# Altium schematic sheet main sheet.SchDoc
size A4
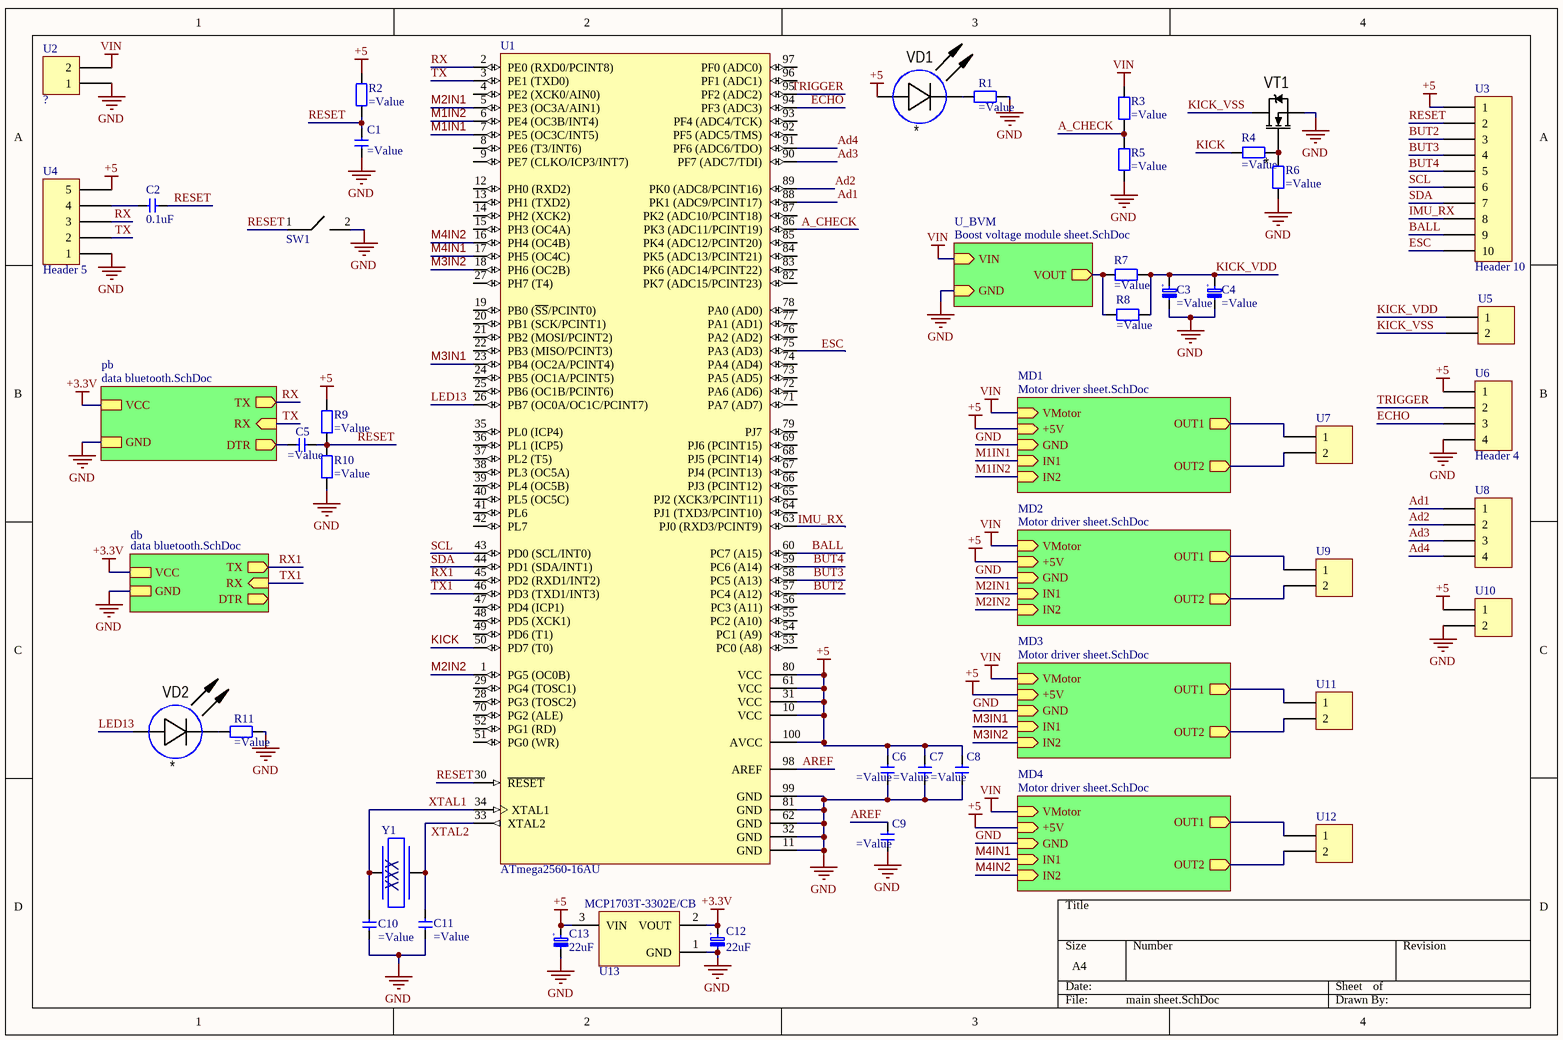
[diagram p0: main sheet.SchDoc]

## Parts
C1  (no value)  [cap0603]
C2  0.1uF  [cap0603]
C3  (no value)  [CAP63V2200uF]
C4  (no value)  [CAP63V2200uF]
C5  (no value)  [cap0603]
C6  (no value)  [cap0603]
C7  (no value)  [cap0603]
C8  (no value)  [cap0603]
C9  (no value)  [cap0603]
C10  (no value)  [cap0603]
C11  (no value)  [cap0603]
C12  22uF  [Tantal B]
C13  22uF  [Tantal B]
R1  (no value)  [res0603]
R2  (no value)  [res0603]
R3  (no value)  [res0603]
R4  (no value)  [res0603]
R5  (no value)  [res0603]
R6  (no value)  [res0603]
R7  (no value)  [smd2512]
R8  (no value)  [smd2512]
R9  (no value)  [res0603]
R10  (no value)  [res0603]
R11  (no value)  [res0603]
SW1  Switch  [Switch]  (value not drawn)
U1  ATmega2560-16AU  [100A_N]
U2  ?  [XT30]
U3  Header 10  [10x1.25]
U4  Header 5  [5x2.54]
U5  ?  [XT30]  (value not drawn)
U6  Header 4  [4x1.27]
U7  Header 2  [2x2.54]  (value not drawn)
U8  Header 4  [4x1.25]  (value not drawn)
U9  Header 2  [2x2.54]  (value not drawn)
U10  Header 2  [2x1.25]  (value not drawn)
U11  Header 2  [2x2.54]  (value not drawn)
U12  Header 2  [2x2.54]  (value not drawn)
U13  MCP1703T-3302E/CB  [SOT-23A-CB3_N]
VD1  *  [CH0603LB]
VD2  *  [CH0603LB]
VT1  *  [DPAK_132]
Y1  XXX  [QSMD3.2x2.5_A]

## Sub-sheets
db = data bluetooth.SchDoc: TX (out), GND, VCC, RX (in), DTR (out)
MD1 = Motor driver sheet.SchDoc: VMotor (in), +5V (in), GND (in), IN1 (in), IN2 (in), OUT1 (out), OUT2 (out)
MD2 = Motor driver sheet.SchDoc: VMotor (in), +5V (in), GND (in), IN1 (in), IN2 (in), OUT1 (out), OUT2 (out)
MD3 = Motor driver sheet.SchDoc: VMotor (in), +5V (in), GND (in), IN1 (in), IN2 (in), OUT1 (out), OUT2 (out)
MD4 = Motor driver sheet.SchDoc: VMotor (in), +5V (in), GND (in), IN1 (in), IN2 (in), OUT1 (out), OUT2 (out)
pb = data bluetooth.SchDoc: TX (out), RX (in), GND, VCC, DTR (out)
U_BVM = Boost voltage module sheet.SchDoc: VIN (in), GND (in), VOUT (out)

## Nets
+3.3V: C12.2(PLUS) U13.2(VOUT) ; sheet db/VCC, sheet pb/VCC
+5: C6.2 C7.2 C8.2 C13.2(PLUS) R2.2 R9.2 U1.10(VCC) U1.31(VCC) U1.61(VCC) U1.80(VCC) U1.100(AVCC) U3.1 U4.5 U6.1 U10.1 U13.3(VIN) VD1.1(A) ; sheet MD1/+5V, sheet MD2/+5V, sheet MD3/+5V, sheet MD4/+5V
GND: C1.1 C3.2(MINUS) C4.2(MINUS) C6.1 C7.1 C8.1 C9.1 C10.1 C11.1 C12.1(MINUS) C13.1(MINUS) R1.2 R5.1 R6.1 R10.1 R11.2 SW1.2 U1.11(GND) U1.32(GND) U1.62(GND) U1.81(GND) U1.99(GND) U2.1 U4.1 U6.4 U10.2 U13.1(GND) VT1.3(S) ; sheet MD1/GND, sheet MD2/GND, sheet MD3/GND, sheet MD4/GND, sheet db/GND, sheet pb/GND, sheet U_BVM/GND
VIN: R3.2 U2.2 ; sheet MD1/VMotor, sheet MD2/VMotor, sheet MD3/VMotor, sheet MD4/VMotor, sheet U_BVM/VIN
A_CHECK: R3.1 R5.2 U1.86(PK3_(ADC11/PCINT19))
Ad1: U1.88(PK1_(ADC9/PCINT17)) U8.1
Ad2: U1.89(PK0_(ADC8/PCINT16)) U8.2
Ad3: U1.90(PF7_(ADC7/TDI)) U8.3
Ad4: U1.91(PF6_(ADC6/TDO)) U8.4
AREF: C9.2 U1.98(AREF)
BALL: U1.60(PC7_(A15)) U3.9
BUT2: U1.57(PC4_(A12)) U3.3
BUT3: U1.58(PC5_(A13)) U3.4
BUT4: U1.59(PC6_(A14)) U3.5
ECHO: U1.94(PF3_(ADC3)) U6.3
ESC: U1.75(PA3_(AD3)) U3.10
IMU_RX: U1.63(PJ0_(RXD3/PCINT9)) U3.8
KICK: R4.1 U1.50(PD7_(T0))
KICK_VDD: C3.1(PLUS) C4.1(PLUS) R7.2 R8.2 U5.1
KICK_VSS: U5.2 VT1.2(D)
LED13: U1.26(PB7_(OC0A/OC1C/PCINT7)) VD2.1(A)
M1IN1: U1.7(PE5_(OC3C/INT5)) ; sheet MD1/IN1
M1IN2: U1.6(PE4_(OC3B/INT4)) ; sheet MD1/IN2
M2IN1: U1.5(PE3_(OC3A/AIN1)) ; sheet MD2/IN1
M2IN2: U1.1(PG5_(OC0B)) ; sheet MD2/IN2
M3IN1: U1.23(PB4_(OC2A/PCINT4)) ; sheet MD3/IN1
M3IN2: U1.18(PH6_(OC2B)) ; sheet MD3/IN2
M4IN1: U1.17(PH5_(OC4C)) ; sheet MD4/IN1
M4IN2: U1.16(PH4_(OC4B)) ; sheet MD4/IN2
RESET: C1.2 C2.2 C5.2 R2.1 R9.1 R10.2 SW1.1 U1.30(~{RESET}) U3.2
RX: U1.2(PE0_(RXD0/PCINT8)) U4.3 ; sheet pb/TX
RX1: U1.45(PD2_(RXD1/INT2)) ; sheet db/TX
SCL: U1.43(PD0_(SCL/INT0)) U3.6
SDA: U1.44(PD1_(SDA/INT1)) U3.7
TRIGGER: U1.95(PF2_(ADC2)) U6.2
TX: U1.3(PE1_(TXD0)) U4.2 ; sheet pb/RX
TX1: U1.46(PD3_(TXD1/INT3)) ; sheet db/RX
XTAL1: C10.2 U1.34(XTAL1) Y1.1
XTAL2: C11.2 U1.33(XTAL2) Y1.2
NetC2_1: C2.1 U4.4
NetC5_1: C5.1 ; sheet pb/DTR
NetR1_1: R1.1 VD1.2(C)
NetR4_2: R4.2 R6.2 VT1.1(G)
NetR7_1: R7.1 R8.1 ; sheet U_BVM/VOUT
NetR11_1: R11.1 VD2.2(C)
NetU7_1: U7.1 ; sheet MD1/OUT1
NetU7_2: U7.2 ; sheet MD1/OUT2
NetU9_1: U9.1 ; sheet MD2/OUT1
NetU9_2: U9.2 ; sheet MD2/OUT2
NetU11_1: U11.1 ; sheet MD3/OUT1
NetU11_2: U11.2 ; sheet MD3/OUT2
NetU12_1: U12.1 ; sheet MD4/OUT1
NetU12_2: U12.2 ; sheet MD4/OUT2

Not connected (* = marked no-connect by the designer): U1 4(PE2_(XCK0/AIN0)) 8(PE6_(T3/INT6)) 9(PE7_(CLKO/ICP3/INT7)) 12(PH0_(RXD2)) 13(PH1_(TXD2)) 14(PH2_(XCK2)) 15(PH3_(OC4A)) 19(PB0_(~{SS}/PCINT0)) 20(PB1_(SCK/PCINT1)) 21(PB2_(MOSI/PCINT2)) 22(PB3_(MISO/PCINT3)) 24(PB5_(OC1A/PCINT5)) 25(PB6_(OC1B/PCINT6)) 27(PH7_(T4)) 28(PG3_(TOSC2)) 29(PG4_(TOSC1)) 35(PL0_(ICP4)) 36(PL1_(ICP5)) 37(PL2_(T5)) 38(PL3_(OC5A)) 39(PL4_(OC5B)) 40(PL5_(OC5C)) 41(PL6) 42(PL7) 47(PD4_(ICP1)) 48(PD5_(XCK1)) 49(PD6_(T1)) 51(PG0_(WR)) 52(PG1_(RD)) 53(PC0_(A8)) 54(PC1_(A9)) 55(PC2_(A10)) 56(PC3_(A11)) 64(PJ1_(TXD3/PCINT10)) 65(PJ2_(XCK3/PCINT11)) 66(PJ3_(PCINT12)) 67(PJ4_(PCINT13)) 68(PJ5_(PCINT14)) 69(PJ6_(PCINT15)) 70(PG2_(ALE)) 71(PA7_(AD7)) 72(PA6_(AD6)) 73(PA5_(AD5)) 74(PA4_(AD4)) 76(PA2_(AD2)) 77(PA1_(AD1)) 78(PA0_(AD0)) 79(PJ7) 82(PK7_(ADC15/PCINT23)) 83(PK6_(ADC14/PCINT22)) 84(PK5_(ADC13/PCINT21)) 85(PK4_(ADC12/PCINT20)) 87(PK2_(ADC10/PCINT18)) 92(PF5_(ADC5/TMS)) 93(PF4_(ADC4/TCK)) 96(PF1_(ADC1)) 97(PF0_(ADC0))

## Notes on the sheet
- (in symbol Cap Aluminum) +
- (in symbol Cap Tantal) +

## Library data of the parts
C1 C2 C5-C11 = Cap SMD
C3 C4 = Cap Aluminum
C12 C13 = Cap Tantal
R1-R11 = Resistor SMD
U1 = ATmega2560-16AU: 8-bit AVR Microcontroller, 4.5-5.5V, 256KB Flash, 4KB EEPROM, 8KB SRAM, 86 GPIO pins, 100-pin TQFP, Industrial Grade (-40°C to 85°C), Pb-Free; Published: 1-Apr-2010; DatasheetVersion: revL, Aug-2007; PackageVersion: revC, Oct-2001; PackageReference: 100A; Publisher: Altium Limited; PackageDescription: 100-Pin Thin Profile Plastic Quad Flat Pack (TQFP), 14 x 14 x 1.0 mm Body, 0.5 mm Pitch; Supplier 1: Digi-Key; Supplier Part Number 1: ATMEGA2560-16AU-ND; Supplier 2: Farnell; Supplier Part Number 2: 1288330; Supplier 3: Farnell; Supplier Part Number 3: 1661740; Supplier 4: Mouser; Supplier Part Number 4: 556-ATMEGA2560-16AU; Code_JEDEC: MS-026-AED; ComponentLink1Description: Manufacturer Link; ComponentLink1URL: http://www.atmel.com/products/avr/default.asp?; ComponentLink2Description: ATmega640/1280/1281/2560/2561 Datasheet; ComponentLink2URL: http://www.atmel.com/dyn/resources/prod_documents/doc2549.pdf; ComponentLink3Description: ATmega640/1280/1281/2560/2561 Summary; ComponentLink3URL: http://www.atmel.com/dyn/resources/prod_documents/2549S.pdf; ComponentLink4Description: Atmel.com Home; ComponentLink4URL: http://www.atmel.com
U2 U5 = Power connectors
U13 = MCP1703T-3302E/CB: 250 mA, 16V, Low Quiescent Current LDO Regulator, 3-Pin SOT-23A, Extended Temperature, Tape and Reel; Published: 29-Jan-2009; DatasheetVersion: revD, Sep-2009; PackageVersion: revBB, Aug-2009; PackageReference: SOT-23A-CB3; Publisher: Altium Limited; PackageDescription: 3-Lead Plastic Small Outline Transistor (CB) [SOT-23A]; Supplier 1: Digi-Key; Supplier Part Number 1: MCP1703T-3302E/CBTR-ND; Supplier 2: Digi-Key; Supplier Part Number 2: MCP1703T-3302E/CBCT-ND; Supplier 3: Digi-Key; Supplier Part Number 3: MCP1703T-3302E/CBDKR-ND; Supplier 4: Farnell; Supplier Part Number 4: 1439518; ComponentLink1Description: Datasheet; ComponentLink1URL: http://ww1.microchip.com/downloads/en/DeviceDoc/22049d.pdf; ComponentLink2Description: Packaging Specification; ComponentLink2URL: http://www.microchip.com/stellent/groups/techpub_sg/documents/packagingspec/en012702.pdf; ComponentLink3Description: Microchip.com Home; ComponentLink3URL: http://www.microchip.com/
VD1 VD2 = LED: Manufacturer: *; Model: *; HelpURL: *; ComponentKind: *; Value: *
VT1 = N-chanel: Mosfet; Model: *; Manufacturer: *; ComponentKind: *; HelpURL: *
Y1 = Crystal: Кварцевый резонатор; Value: XXX